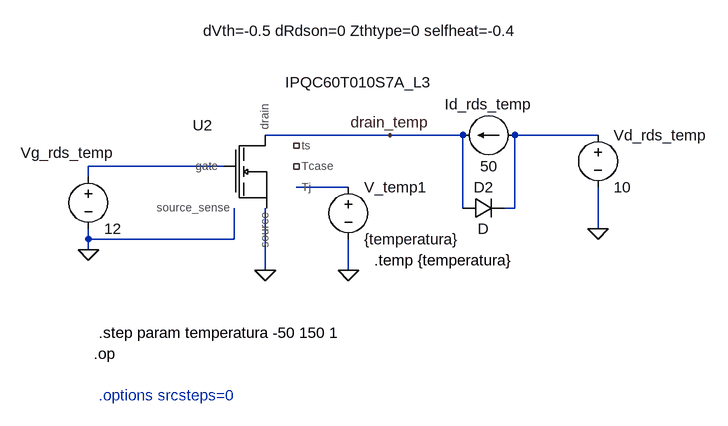
[diagram p0: schematic Si_MOSFET_Rds_temp.asc]
Si_MOSFET_Rds_temp.asc, the LTspice schematic file:
Version 4.1
SHEET 1 888 1272
WIRE 384 752 192 752
WIRE 496 752 384 752
WIRE 704 752 576 752
WIRE 128 800 -80 800
WIRE -80 816 -80 800
WIRE 320 832 240 832
WIRE 496 864 496 752
WIRE 576 864 576 752
WIRE 576 864 560 864
WIRE 704 896 704 832
WIRE -80 912 -80 896
WIRE 144 912 144 864
WIRE 144 912 -80 912
WIRE -80 928 -80 912
WIRE 192 960 192 864
WIRE 320 960 320 912
FLAG -80 928 0
FLAG 192 960 0
FLAG 320 960 0
FLAG 704 896 0
FLAG 384 752 drain_temp
SYMBOL IPQC60T010S7_L3 192 816 R0
WINDOW 3 144 -161 Top 2
WINDOW 39 148 -240 Top 2
SYMATTR InstName U2
SYMATTR SpiceLine dVth=-0.5 dRdson=0 Zthtype=0 selfheat=-0.4
SYMBOL voltage -80 800 R0
WINDOW 0 -104 -21 Left 2
WINDOW 123 0 0 Left 0
WINDOW 39 0 0 Left 0
SYMATTR InstName Vg_rds_temp
SYMATTR Value 12
SYMBOL voltage 320 816 R0
WINDOW 123 0 0 Left 0
WINDOW 39 0 0 Left 0
SYMATTR InstName V_temp1
SYMATTR Value {temperatura}
SYMBOL current 576 752 R90
WINDOW 0 -32 40 VBottom 2
WINDOW 3 32 40 VTop 2
WINDOW 123 0 0 Left 0
WINDOW 39 0 0 Left 0
SYMATTR InstName Id_rds_temp
SYMATTR Value 50
SYMBOL diode 496 880 R270
WINDOW 0 32 32 VTop 2
WINDOW 3 0 32 VBottom 2
SYMATTR InstName D2
SYMBOL voltage 704 736 R0
SYMATTR InstName Vd_rds_temp
SYMATTR Value 10
TEXT 360 944 Left 2 !.temp {temperatura}
TEXT -64 1056 Left 2 !.step param temperatura -50 150 1
TEXT -72 1088 Left 2 !.op
TEXT -64 1152 Left 2 ;.options srcsteps=0

The netlist it stands for:
* Si_MOSFET_Rds_temp.asc
X§U2 drain_temp N002 0 0 NC_01 N003 NC_02 IPQC60T010S7A_L3 dVth=-0.5 dRdson=0 Zthtype=0 selfheat=-0.4  ; pins drain gate source source_sense ts Tj Tcase
Vg_rds_temp N002 0 12
V_temp1 N003 0 {temperatura}
Id_rds_temp N001 drain_temp 50
D2 drain_temp N001 D
Vd_rds_temp N001 0 10
.model D D
.lib standard.dio
.temp {temperatura}
.step param temperatura -50 150 1
.op
* .options srcsteps=0
.lib IFX_S7A_TS_600V.lib
.backanno
.end